# EAGLE design VentilationSystem_Rele (EAGLE 7.5.0)
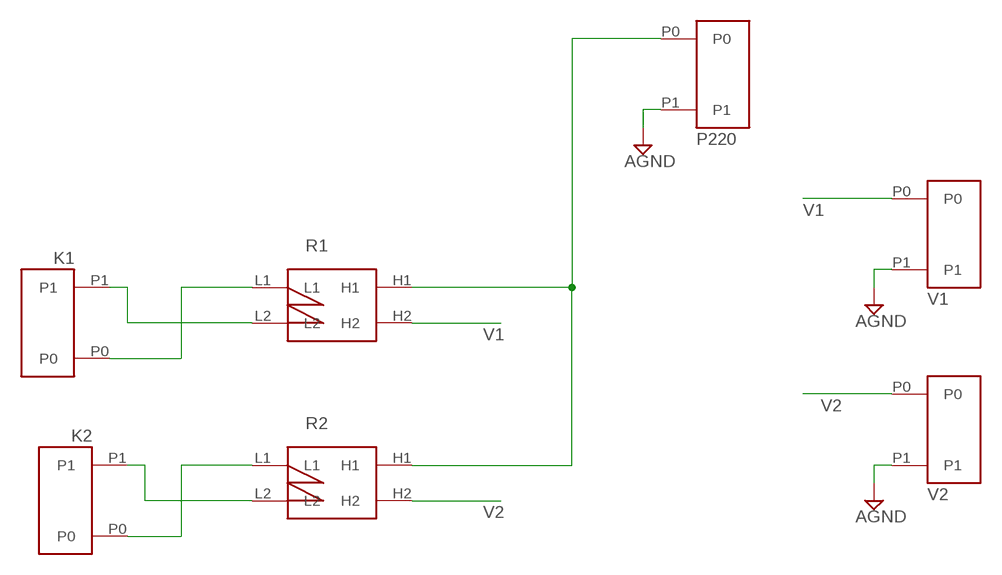
[diagram p0: schematic, sheet 1]

## Parts
K1  RAIL_2  [RAIL_2]
K2  RAIL_2  [RAIL_2]
P220  RAIL_2  [RAIL_2]
R1  NPR-RELE  [NPR-RELE]
R2  NPR-RELE  [NPR-RELE]
V1  RAIL_2  [RAIL_2]
V2  RAIL_2  [RAIL_2]

## Nets
AGND: P220.P1 V1.P1 V2.P1
N$1: K2.P1 R2.L2
N$2: K1.P0 R1.L1
N$3: K1.P1 R1.L2
N$4: K2.P0 R2.L1
N$5: P220.P0 R1.H1 R2.H1
V1: R1.H2 V1.P0
V2: R2.H2 V2.P0

## Library data of the parts
K1 K2 P220 V1 V2 = My_HV_Components:RAIL_2
R1 R2 = My_HV_Components:NPR-RELE

## Board
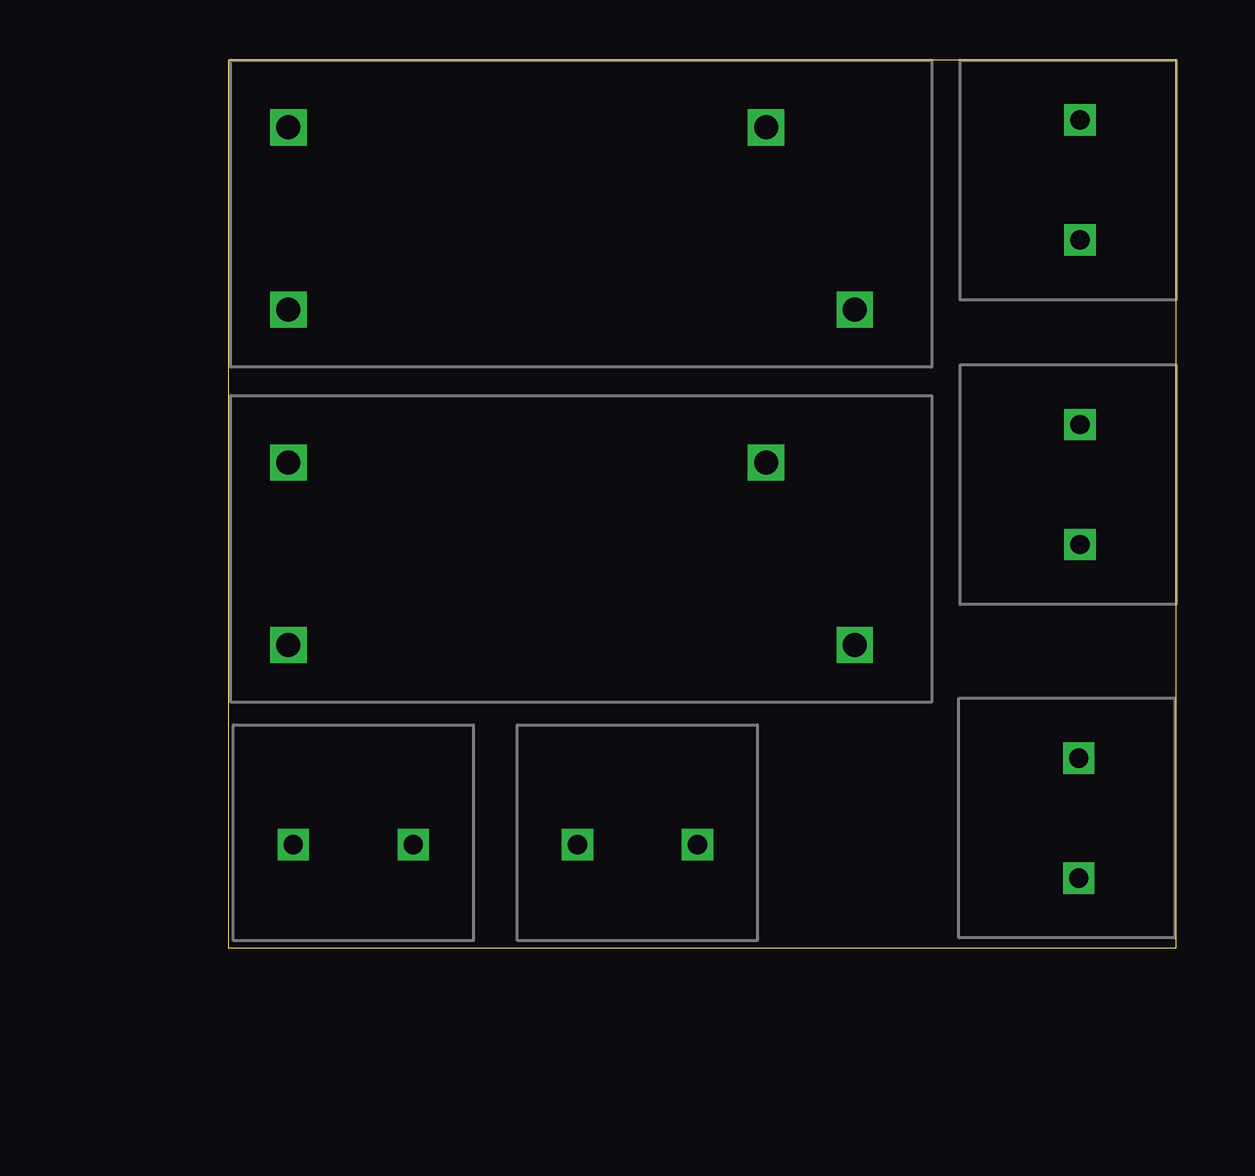
[diagram p1: board, top side]
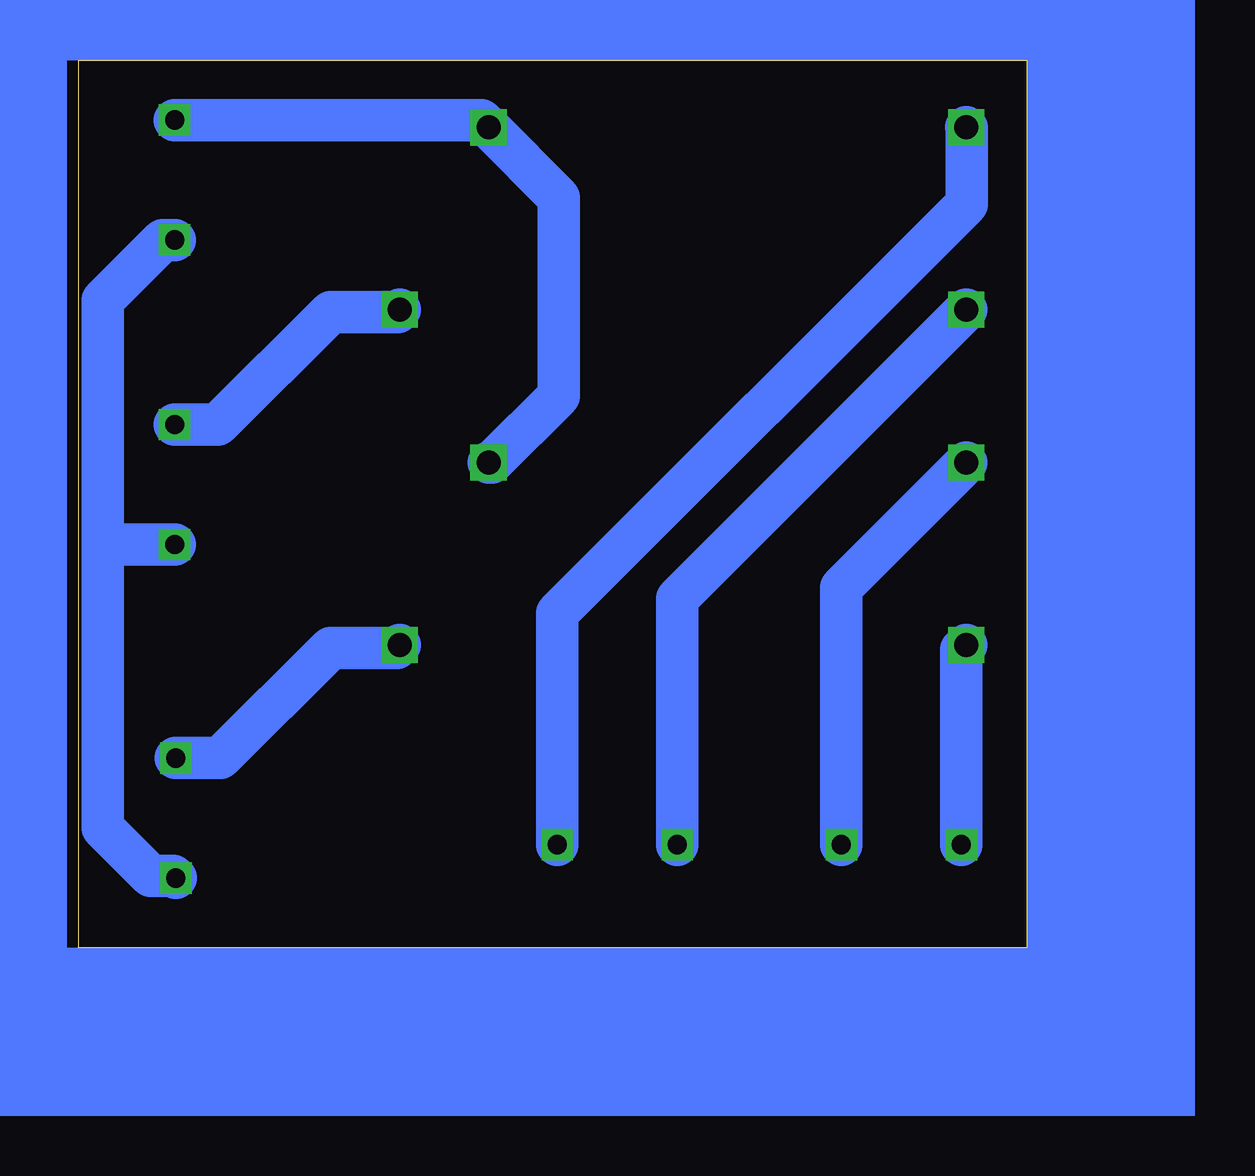
[diagram p2: board, bottom side, seen from below]

Size 39.5 x 37 mm. Coordinates in mm from the lower left corner, seen from the top.
Outline: 0,0 39.5,0 39.5,37 0,37 0,0
Copper layers (1*16): Top 0.035mm / dielectric 1.5mm / Bottom 0.035mm
Design rules "default": minimum track width 10mil, minimum drill 24mil, track to track 8mil, track to pad 8mil, pad to pad 8mil, via to via 8mil, smd to smd 8mil, copper to edge 40mil, drill to drill 8mil, minimum pad ring 10mil, minimum via ring 8mil, stop-mask expansion 4mil, vias tented up to drill 0mil, thermal gap 10mil

### Footprints (pad centres in the part's own frame; a part is rotated, then mirrored left to right if it is on the bottom)
RAIL_2 = drill 0.8 square: P0 0,2.5; P1 0,-2.5
NPR-RELE = drill 1 square: H1 9.9,3.6; H2 13.6,-4; L1 -10,3.6; L2 -10,-4

### Placement (x,y rotation side)
K1  5.22,4.29 270 top
K2  17.06,4.29 270 top
P220  35.5,32 0 top
R1  12.52,16.62 0 top
R2  12.52,30.59 0 top
V1  35.45,5.4 0 top
V2  35.5,19.3 0 top

### Tracks (layer width: path | path; a pad name or v marks a point on that pad's centre or on a via)
AGND
  Bottom 1.778: P220.P1 36,29.5 38.5,27 38.5,16.5 | 38.5,16.5 38.5,5 36.5,3 35.55,3 V1.P1 | V2.P1 38.2,16.8 38.5,16.5
N$1
  Bottom 1.778: K2.P1 14.56,14.55 R2.L2
N$2
  Bottom 1.778: K1.P0 7.72,15.02 R1.L1
N$3
  Bottom 1.778: K1.P1 2.72,12.42 R1.L2
N$4
  Bottom 1.778: K2.P0 19.56,13.94 2.5,31 2.5,34.17 R2.L1
N$5
  Bottom 1.778: P220.P0 22.73,34.5 R2.H1 19.5,31.27 19.5,23 22.28,20.22 R1.H1
V1
  Bottom 1.778: V1.P0 33.6,7.9 29,12.5 26.24,12.5 R1.H2
V2
  Bottom 1.778: V2.P0 33.7,21.8 29,26.5 26.21,26.5 R2.H2
(copper drawn outside any net)
  shapes: Bottom area x5